# EAGLE design LEDStick_v01 (EAGLE 5.11)
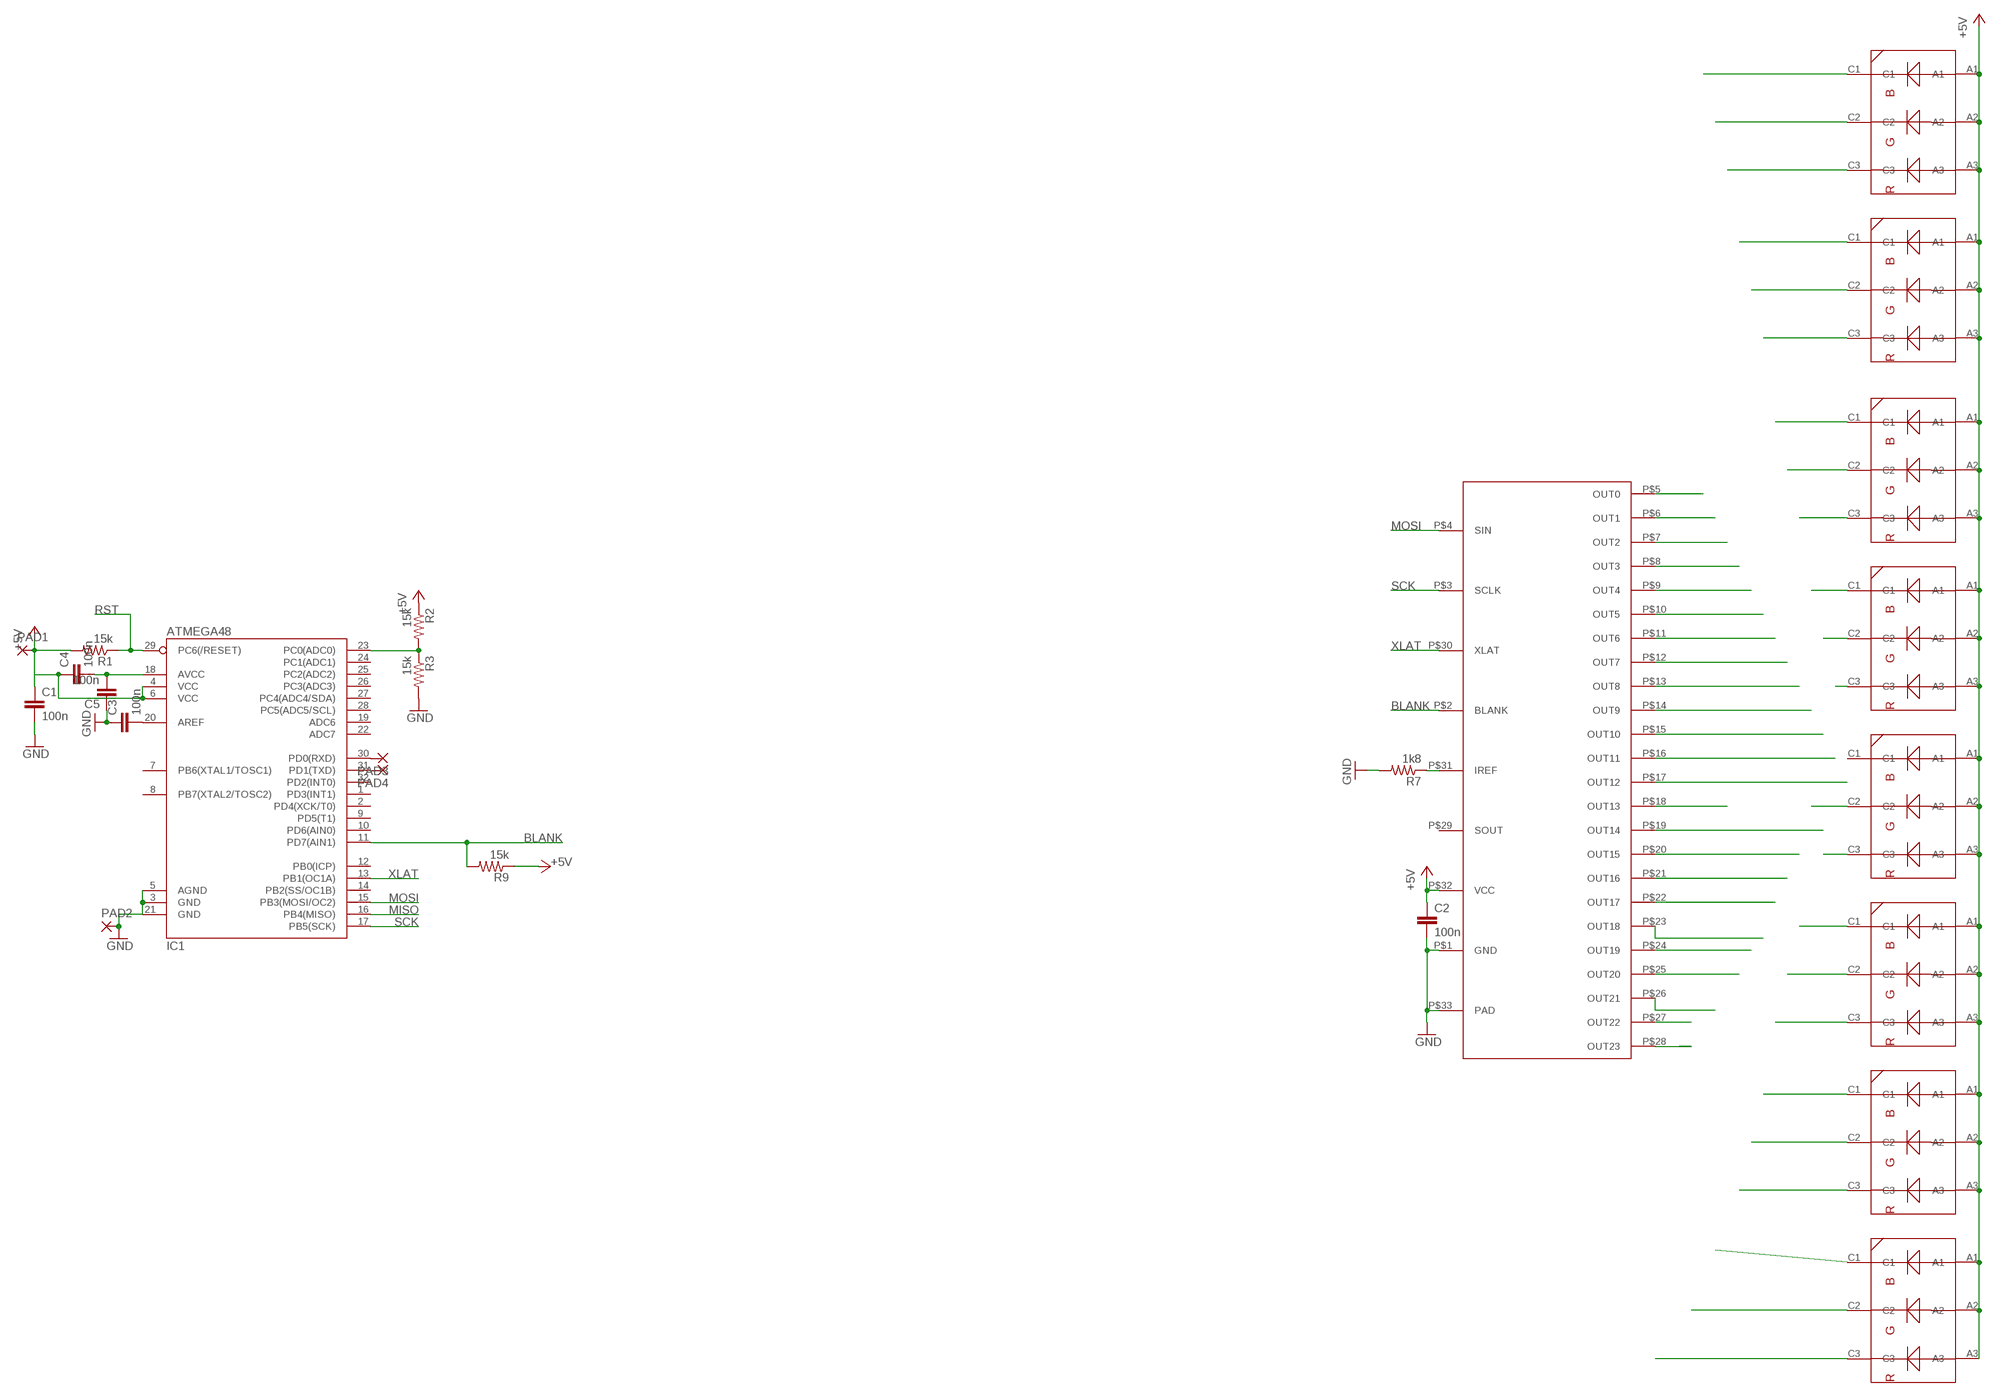
[diagram p0: schematic, sheet 1]

## Parts
C1  100n  CAP0805  [0805]
C2  100n  CAP0805  [0805]
C3  100n  CAP0805  [0805]
C4  100n  CAP0805  [0805]
C5  100n  CAP0805  [0805]
IC1  ATMEGA48  ATMEGA168  [TQFP32-08]
IC2  TLC5947  [HTSSOP32_DAP]
PAD1  SMD5  [SMD2,54-5,08]
PAD2  SMD5  [SMD2,54-5,08]
PAD3  SMD5  [SMD2,54-5,08]
PAD4  SMD5  [SMD2,54-5,08]
R1  15k  RESISTOR  [0805]
R2  15k  RESISTOR  [0805]
R3  15k  RESISTOR  [0805]
R7  1k8  RESISTOR  [0805]
R9  15k  RESISTOR  [0805]
U$1  OSRAM_LRTB_GFTGSMALL  [PLCC-6_SMALL]
U$2  OSRAM_LRTB_GFTGSMALL  [PLCC-6_SMALL]
U$3  OSRAM_LRTB_GFTGSMALL  [PLCC-6_SMALL]
U$4  OSRAM_LRTB_GFTGSMALL  [PLCC-6_SMALL]
U$5  OSRAM_LRTB_GFTGSMALL  [PLCC-6_SMALL]
U$6  OSRAM_LRTB_GFTGSMALL  [PLCC-6_SMALL]
U$7  OSRAM_LRTB_GFTGSMALL  [PLCC-6_SMALL]
U$8  OSRAM_LRTB_GFTGSMALL  [PLCC-6_SMALL]

## Nets
+5V: C1.1 C2.1 C4.1 IC1.4(VCC) IC1.6(VCC) IC2.P$32(VCC) PAD1.1(P) R1.2 R2.1 R9.1 U$1.A1 U$1.A2 U$1.A3 U$2.A1 U$2.A2 U$2.A3 U$3.A1 U$3.A2 U$3.A3 U$4.A1 U$4.A2 U$4.A3 U$5.A1 U$5.A2 U$5.A3 U$6.A1 U$6.A2 U$6.A3 U$7.A1 U$7.A2 U$7.A3 U$8.A1 U$8.A2 U$8.A3
BLANK: IC1.11(PD7(AIN1)) IC2.P$2(BLANK) R9.2
GND: C1.2 C2.2 C3.1 C5.1 IC1.3(GND) IC1.5(AGND) IC1.21(GND) IC2.P$1(GND) IC2.P$33(PAD) PAD2.1(P) R3.2 R7.2
MISO: IC1.16(PB4(MISO))
MOSI: IC1.15(PB3(MOSI/OC2)) IC2.P$4(SIN)
N$1: U$1.C3
N$2: U$1.C2
N$3: U$1.C1
N$4: U$2.C3
N$5: IC2.P$24(OUT19)
N$6: IC2.P$23(OUT18)
N$7: IC2.P$22(OUT17)
N$8: IC2.P$21(OUT16)
N$9: IC2.P$20(OUT15)
N$10: IC2.P$19(OUT14)
N$11: IC2.P$18(OUT13)
N$12: IC2.P$31(IREF) R7.1
N$13: IC2.P$17(OUT12)
N$14: IC2.P$16(OUT11)
N$15: IC2.P$15(OUT10)
N$16: IC2.P$14(OUT9)
N$17: IC2.P$13(OUT8)
N$18: IC2.P$12(OUT7)
N$19: IC2.P$11(OUT6)
N$20: IC2.P$10(OUT5)
N$21: U$7.C2
N$22: U$7.C1
N$23: U$8.C3
N$24: U$8.C2
N$25: U$8.C1
N$26: IC2.P$27(OUT22)
N$27: IC2.P$26(OUT21)
N$28: IC2.P$25(OUT20)
N$29: U$2.C2
N$30: C3.2 IC1.20(AREF)
N$31: U$2.C1
N$32: IC1.23(PC0(ADC0)) R2.2 R3.1
N$33: U$3.C3
N$34: U$3.C2
N$35: U$3.C1
N$36: U$4.C3
N$37: U$5.C3
N$38: U$5.C2
N$39: U$5.C1
N$40: U$6.C3
N$41: U$6.C2
N$42: U$6.C1
N$43: U$7.C3
N$44: IC2.P$9(OUT4)
N$45: IC2.P$8(OUT3)
N$46: IC2.P$7(OUT2)
N$47: IC2.P$6(OUT1)
N$48: IC2.P$5(OUT0)
N$49: U$4.C2
N$50: IC2.P$28(OUT23)
N$52: C4.2 C5.2 IC1.18(AVCC)
N$53: IC1.30(PD0(RXD)) PAD3.1(P)
N$54: IC1.31(PD1(TXD)) PAD4.1(P)
RST: IC1.29(PC6(/RESET)) R1.1
SCK: IC1.17(PB5(SCK)) IC2.P$3(SCLK)
XLAT: IC1.13(PB1(OC1A)) IC2.P$30(XLAT)
Unconnected: IC1.1(PD3(INT1)) IC1.2(PD4(XCK/T0)) IC1.7(PB6(XTAL1/TOSC1)) IC1.8(PB7(XTAL2/TOSC2)) IC1.9(PD5(T1)) IC1.10(PD6(AIN0)) IC1.12(PB0(ICP)) IC1.14(PB2(SS/OC1B)) IC1.19(ADC6) IC1.22(ADC7) IC1.24(PC1(ADC1)) IC1.25(PC2(ADC2)) IC1.26(PC3(ADC3)) IC1.27(PC4(ADC4/SDA)) IC1.28(PC5(ADC5/SCL)) IC1.32(PD2(INT0)) IC2.P$29(SOUT) U$4.C1

## Library data of the parts
C1-C5 = SparkFun:CAP: Capacitor Standard 0603 ceramic capacitor, and 0.1" leaded capacitor.
IC1 = SparkFun:ATMEGA168
IC2 = tlc5947:TLC5947
PAD1-PAD4 = wirepad:SMD5: SMD PAD
R1-R3 R7 R9 = SparkFun:RESISTOR: Resistor Basic schematic elements and footprints for 0603, 1206, and PTH 1/10th watt (small) resistors.
U$1-U$8 = seb:OSRAM_LRTB_GFTG

## Board
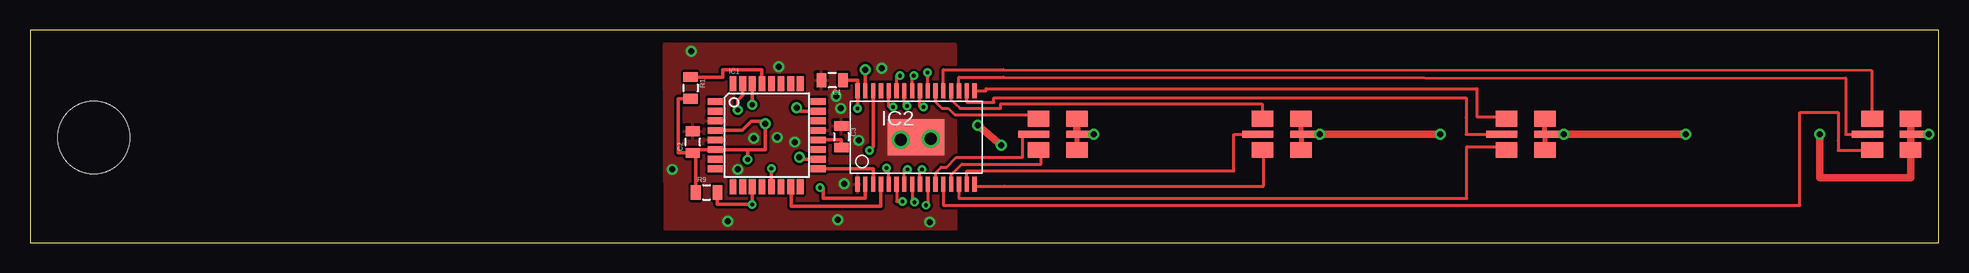
[diagram p1: board, top side]
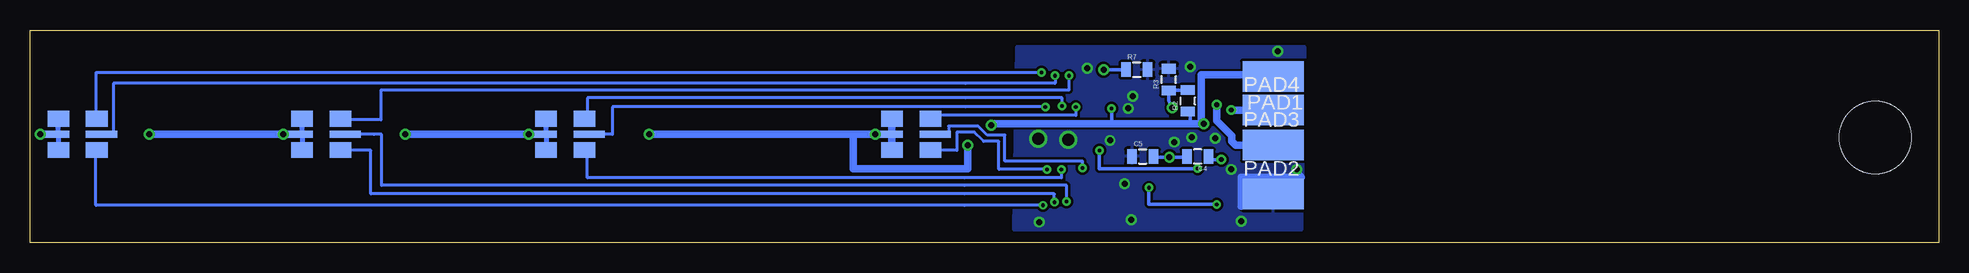
[diagram p2: board, bottom side, seen from below]

Size 159.08 x 17.72 mm. Coordinates in mm from the lower left corner, seen from the top.
Outline: 0,0 159.08,0 159.08,17.72 0,17.72 0,0
Copper layers (1*16): Top 0.035mm / dielectric 1.5mm / Bottom 0.035mm
Design rules "default *": minimum track width 10mil, minimum drill 0.3mm, track to track 8mil, track to pad 8mil, pad to pad 8mil, via to via 8mil, smd to smd 8mil, copper to edge 15mil, drill to drill 8mil, minimum pad ring 10mil, minimum via ring 8mil, stop-mask expansion 4mil, vias tented up to drill 50mil, thermal gap 10mil
Holes 6 mm at 5.32,8.76

### Footprints (pad centres in the part's own frame; a part is rotated, then mirrored left to right if it is on the bottom)
0805 = smd 0.8 x 1.2: 1 -0.9,0; 2 0.9,0
TQFP32-08 = smd 1.27 x 0.559: 1 -4.293,2.8; 2 -4.293,2; 3 -4.293,1.2; 4 -4.293,0.4; 5 -4.293,-0.4; 6 -4.293,-1.2; 7 -4.293,-2; 8 -4.293,-2.8; 17 4.293,-2.8; 18 4.293,-2; 19 4.293,-1.2; 20 4.293,-0.4; 21 4.293,0.4; 22 4.293,1.2; 23 4.293,2; 24 4.293,2.8 | smd 0.559 x 1.27: 9 -2.8,-4.293; 10 -2,-4.293; 11 -1.2,-4.293; 12 -0.4,-4.293; 13 0.4,-4.293; 14 1.2,-4.293; 15 2,-4.293; 16 2.8,-4.293; 25 2.8,4.293; 26 2,4.293; 27 1.2,4.293; 28 0.4,4.293; 29 -0.4,4.293; 30 -1.2,4.293; 31 -2,4.293; 32 -2.8,4.293
HTSSOP32_DAP = smd 0.356 x 1.27: P$1 -4.875,-3.9; P$2 -4.225,-3.9; P$3 -3.575,-3.9; P$4 -2.925,-3.9; P$5 -2.275,-3.9; P$6 -1.625,-3.9; P$7 -0.975,-3.9; P$8 -0.325,-3.9; P$9 0.325,-3.9; P$10 0.975,-3.9; P$11 1.625,-3.9; P$12 2.275,-3.9; P$13 2.925,-3.9; P$14 3.575,-3.9; P$15 4.225,-3.9; P$16 4.875,-3.9; P$17 4.875,3.9; P$18 4.225,3.9; P$19 3.575,3.9; P$20 2.925,3.9; P$21 2.275,3.9; P$22 1.625,3.9; P$23 0.975,3.9; P$24 0.325,3.9; P$25 -0.325,3.9; P$26 -0.975,3.9; P$27 -1.625,3.9; P$28 -2.275,3.9; P$29 -2.925,3.9; P$30 -3.575,3.9; P$31 -4.225,3.9; P$32 -4.875,3.9 | smd 4.698 x 3: P$33 0,0
SMD2,54-5,08 = smd 2.54 x 5.08: 1 0,0
PLCC-6_SMALL = smd 1.3 x 1.8: A1 1.3,-1.6; A3 -1.3,-1.6; C1 1.3,1.6; C3 -1.3,1.6 | smd 0.6 x 2.6: A2 0,-2; C2 0,2

### Placement (x,y rotation side)
C1  66.85,13.53 180 top
C2  55.23,8.38 90 top
C3  67.61,8.83 270 top
C4  61.77,7.18 180 bottom
C5  66.34,7.18 0 bottom
IC1  61.39,8.95 0 top
IC2  73.84,8.76 0 top
PAD1  55.49,13.84 90 bottom
PAD2  55.49,4.06 270 bottom
PAD3  55.49,8.13 270 bottom
PAD4  55.49,11.05 270 bottom
R1  55.04,12.89 270 top
R2  62.6,11.81 90 bottom
R3  64.19,13.59 90 bottom
R7  66.85,14.41 0 bottom
R9  56.38,4.19 0 top
U$1  155.12,9.02 270 bottom
U$2  124.64,9.02 90 top
U$3  85.65,9.02 270 bottom
U$4  85.65,9.02 90 top
U$5  104.32,9.02 90 top
U$6  114.48,9.02 270 bottom
U$7  155.12,9.02 90 top
U$8  134.8,9.02 270 bottom

### Tracks (layer width: path | path; a pad name or v marks a point on that pad's centre or on a via)
+5V  (via drill 0.3, 0.4, 0.5)
  Top 0.305: v68.95,11.18 68.96,11.18 IC2.P$32 68.96,13.53 C1.1 | 59.68,7.75 IC1.6 55.23,7.75 C2.1 | 59.68,7.75 60.82,7.75 61.26,7.75 61.26,8.95 61.26,9.35 61.26,10.1 | R9.1 55.47,7.74 C2.1 | R1.2 54.03,12 54.03,7.48 C2.1 | IC1.4 59.36,9.35 60.12,10.1 60.88,10.1 | 61.26,10.1 60.88,10.1 | 61.26,10.1 v61.26,9.91 | 61.26,10.1 60.88,10.1 | v59.8,6.92 59.8,7.75 59.68,7.75
  Top 0.406: 156.72,9.02 U$7.A3 | 156.72,9.02 U$7.A2 156.72,9.02 | U$7.A1 156.72,9.02 | 126.24,9.02 U$2.A1 | 126.24,9.02 U$2.A2 126.24,9.02 | 126.24,9.02 U$2.A3 | 105.92,9.02 U$5.A1 | 105.92,9.02 U$5.A2 105.92,9.02 | 105.92,9.02 U$5.A3 | 87.25,9.02 U$4.A3 | 87.25,9.02 U$4.A2 87.25,9.02 | 87.25,9.02 U$4.A1
  Top 0.61: v117.53,9.02 107.43,9.02 v107.49,9.02 U$5.A2 | v137.97,9.02 126.73,9.02 v127.81,9.02 U$2.A2 | U$7.A2 156.72,9.02 U$7.A2 | U$7.A2 v158.23,9.02 | v149.15,9.02 149.15,5.4 155.56,5.4 156.72,5.4 U$7.A1 | v78.98,9.78 v80.95,8.13 | U$4.A1 87.25,9.02 v88.63,9.02
  Bottom 0.305: 68.95,9.91 v68.95,11.18 | R2.1 62.41,10.91 62.41,9.91 | v61.26,9.91 61.46,10.1 v61.26,9.91 | v61.26,9.91 61.9,9.91 | C4.1 60.87,6.92 v59.8,6.92
  Bottom 0.406: 156.72,9.02 U$7.A3 | 156.72,9.02 U$7.A2 156.72,9.02 | 156.72,9.02 U$7.A1 | 136.4,9.02 U$8.A1 | 136.4,9.02 U$8.A2 136.4,9.02 | 136.4,9.02 U$8.A3 | 116.08,9.02 U$6.A3 | 116.08,9.02 U$6.A2 116.08,9.02 | 116.08,9.02 U$6.A1 | U$4.A1 87.25,9.08 | 87.25,9.08 U$4.A2 87.25,9.08 | U$4.A3 87.25,9.08
  Bottom 0.61: v107.49,9.02 96.89,9.02 97.4,9.02 90.47,9.02 | v117.53,9.02 U$6.A2 | U$6.A2 116.08,9.02 | 116.08,9.02 115.68,9.02 116.08,9.02 | U$6.A2 116.08,9.02 | v117.53,9.02 U$6.A2 | v117.53,9.02 v127.81,9.02 | v149.15,9.02 v137.97,9.02 U$8.A2 | v158.23,9.02 U$7.A2 | v117.53,9.02 U$6.A2 | 90.47,9.02 v88.63,9.02 | v88.63,9.02 U$4.A2 | v78.98,9.78 78.98,9.91 69.2,9.91 68.95,9.91 62.41,9.91 61.9,9.91 v61.26,9.91 61.46,10.1 61.46,13.97 | 61.46,13.97 61.2,13.97 | PAD1.1 55.8,13.97 61.2,13.97 | 61.46,13.97 61.2,13.97 | 61.46,13.97 61.2,13.97 | v80.95,8.13 80.95,7.75 80.95,6.16 90.47,6.16 90.47,9.02 | 87.25,9.02 U$4.A3 U$4.A1 87.25,9.02 | v88.63,9.02 87.25,9.02 | v88.63,9.02 87.25,9.02
BLANK  (via drill 0.3)
  Top 0.305: IC2.P$2 69.61,3.68 66.09,3.68 66.09,4.57 v65.84,4.57 | IC1.11 v60.19,3.17 57.28,3.17 R9.2
  Bottom 0.305: v65.84,4.57 65.84,3.17 v60.19,3.17
GND  (via drill 0.5, 1)
  Bottom 0.61: 58.15,3.05 58.15,5.46 53.14,5.46 53.52,5.84 v53.52,6.1
  other vias: 63.74,8.38 58.98,6.1 67.87,4.89 62.28,8.76 60.31,8.7 70.98,14.54 67.55,11.18 67.17,12.19 72.57,8.57 75.04,8.64 62.41,14.67 69.08,8.51 55.11,15.94 58.15,1.78 67.3,1.9 74.98,1.71
  pour Bottom: 52.82,16.32 76.89,16.32 77.14,1.08 53.07,1.08
  pour Top: 52.88,1.14 77.2,1.14 77.14,16.51 52.82,16.51
MOSI
  Top 0.305: IC2.P$4 70.91,3.05 63.42,3.05 63.42,4.66 IC1.15
N$5  (via drill 0.3)
  Top 0.254: IC2.P$24 74.16,11.3 v74.47,11.3
  Bottom 0.254: v74.47,11.3 81.14,11.3 110.54,11.3 110.54,9.02 112.32,9.02
N$6  (via drill 0.3)
  Top 0.254: IC2.P$23 74.81,13.82 v74.79,14.16
  Bottom 0.254: v74.79,14.16 81.14,14.16 153.59,14.16 153.59,10.1
N$7
  Top 0.254: IC2.P$22 75.46,11.71 76,11.18 76.5,11.18 77.08,10.67 83.87,10.67 84.25,10.29
N$8
  Top 0.254: IC2.P$21 76.11,14.42 81.14,14.42 153.47,14.35 153.47,10.22
N$9
  Top 0.254: IC2.P$20 76.76,11.87 77.52,11.18 80.89,11.18 80.89,11.56 102.67,11.56 102.67,10.29
N$10
  Top 0.254: IC2.P$19 77.41,13.78 81.14,13.78 151.31,13.72 151.31,9.02 152.2,9.02
N$11
  Top 0.254: IC2.P$18 78.06,11.68 80.31,11.68 80.31,12.06 119.68,12.06 119.68,10.41 119.68,9.02 121.78,9.02
N$12  (via drill 0.5)
  Top 0.305: v69.61,14.42 IC2.P$31
  Bottom 0.305: R7.1 v69.61,14.42
N$13
  Top 0.254: IC2.P$17 79.65,12.66 79.68,12.64 79.68,12.83 120.57,12.83 120.57,10.48 123.11,10.48
N$14
  Top 0.254: IC2.P$16 78.71,4.7 81.2,4.7 102.79,4.7 102.79,7.75
N$15
  Top 0.254: IC2.P$15 78.06,5.97 81.27,5.97 100.32,5.97 100.32,9.02 101.33,9.02
N$16
  Top 0.254: IC2.P$14 77.41,3.68 81.2,3.68 119.75,3.68 119.75,8 123.18,8
N$17
  Top 0.254: IC2.P$13 76.76,5.66 77.65,6.54 84.25,6.54 84.25,7.68
N$18
  Top 0.254: IC2.P$12 76.11,3.11 81.2,3.11 147.5,3.11 147.5,10.86 150.67,10.86 150.67,8.51 150.67,7.68 153.4,7.68
N$19
  Top 0.254: IC2.P$11 75.46,5.82 75.93,6.29 76.38,6.29 77.2,7.11 82.73,7.11 82.73,9.02 83.17,9.02
N$20  (via drill 0.3)
  Top 0.254: IC2.P$10 74.81,3.11 v74.66,3.11
  Bottom 0.254: v74.66,3.11 81.2,3.11 153.59,3.11 153.59,7.49
N$26  (via drill 0.3)
  Top 0.254: IC2.P$27 72.21,13.91 v72.5,13.91
  Bottom 0.254: v72.5,13.91 72.5,12.7 81.14,12.7 129.84,12.7 129.84,10.22 132.45,10.22 132.45,10.29
N$27  (via drill 0.3)
  Top 0.254: IC2.P$26 72.86,11.37 v73.08,11.37
  Bottom 0.254: v73.08,11.37 73.08,12.06 81.14,12.06 112.64,12.06 112.64,10.35
N$28  (via drill 0.3)
  Top 0.254: IC2.P$25 73.51,13.91 v73.65,13.91
  Bottom 0.254: v73.65,13.91 73.65,13.27 81.14,13.27 152.13,13.27 152.13,9.02 153.53,9.02
N$30
  Top 0.305: IC1.20 67.6,8.55 C3.2
N$32  (via drill 0.5)
  Top 0.305: IC1.23 63.88,10.95 v63.88,11.24
  Bottom 0.305: v63.88,11.24 64.19,11.81 R3.1 63.99,12.71 R2.2
N$44  (via drill 0.3)
  Top 0.254: IC2.P$9 74.16,6.1 v74.35,6.1
  Bottom 0.254: v74.35,6.1 78.35,6.1 78.35,8.45 79.62,8.45 79.68,8.51 80.38,9.21 81.84,9.21 81.84,8.45 81.84,7.68 83.68,7.68
N$45  (via drill 0.3)
  Top 0.254: IC2.P$8 73.51,3.37 v73.71,3.37
  Bottom 0.254: v73.71,3.37 73.71,4.06 81.2,4.06 130.67,4.06 130.67,7.68 132.64,7.68 132.64,7.62
N$46  (via drill 0.3)
  Top 0.254: IC2.P$7 72.86,6.1 v73.14,6.1
  Bottom 0.254: v73.14,6.1 73.14,5.4 81.2,5.4 112.64,5.4 112.64,7.62
N$47  (via drill 0.3)
  Top 0.254: IC2.P$6 72.21,3.43 v72.69,3.43
  Bottom 0.254: v72.69,3.43 72.69,4.76 81.2,4.76 129.78,4.76 129.78,9.02 130.42,9.02 132,9.02
N$48  (via drill 0.3)
  Top 0.254: IC2.P$5 71.56,6.22 v71.36,6.22
  Bottom 0.254: v71.36,6.22 71.36,6.79 77.84,6.79 77.84,8.95 79.3,8.95 80.06,9.72 82.54,9.72 82.54,8.95 83.24,8.95
N$50  (via drill 0.3)
  Top 0.254: IC2.P$28 71.56,11.3 v71.93,11.3
  Bottom 0.254: v71.93,11.3 71.93,10.6 83.68,10.6 83.68,9.97 83.43,9.97
N$52  (via drill 0.5)
  Top 0.305: v64.12,7.11 64.12,6.95 IC1.18
  Bottom 0.305: C4.2 62.67,7.11 v64.12,7.11 65.44,7.11 C5.2
N$53  (via drill 0.4)
  Top 0.305: IC1.30 v60.19,11.49
  Bottom 0.61: v60.19,11.49 60.19,10.16 58.91,8.89 58.91,8.45 58.6,8.13 PAD3.1
N$54  (via drill 0.4)
  Top 0.305: IC1.31 59.39,12.29 58.98,11.87 v58.98,11.05
  Bottom 0.61: PAD4.1 v58.98,11.05
RST
  Top 0.305: IC1.29 60.99,14.42 57.71,14.42 57.71,13.79 R1.1
SCK
  Top 0.305: IC2.P$3 70.26,6.15 IC1.17
XLAT  (via drill 0.3)
  Top 0.305: IC2.P$30 70.26,8 v69.96,7.68 | v61.77,6.16 61.77,4.66 IC1.13
  Bottom 0.305: v69.96,7.68 69.96,6.16 v61.77,6.16